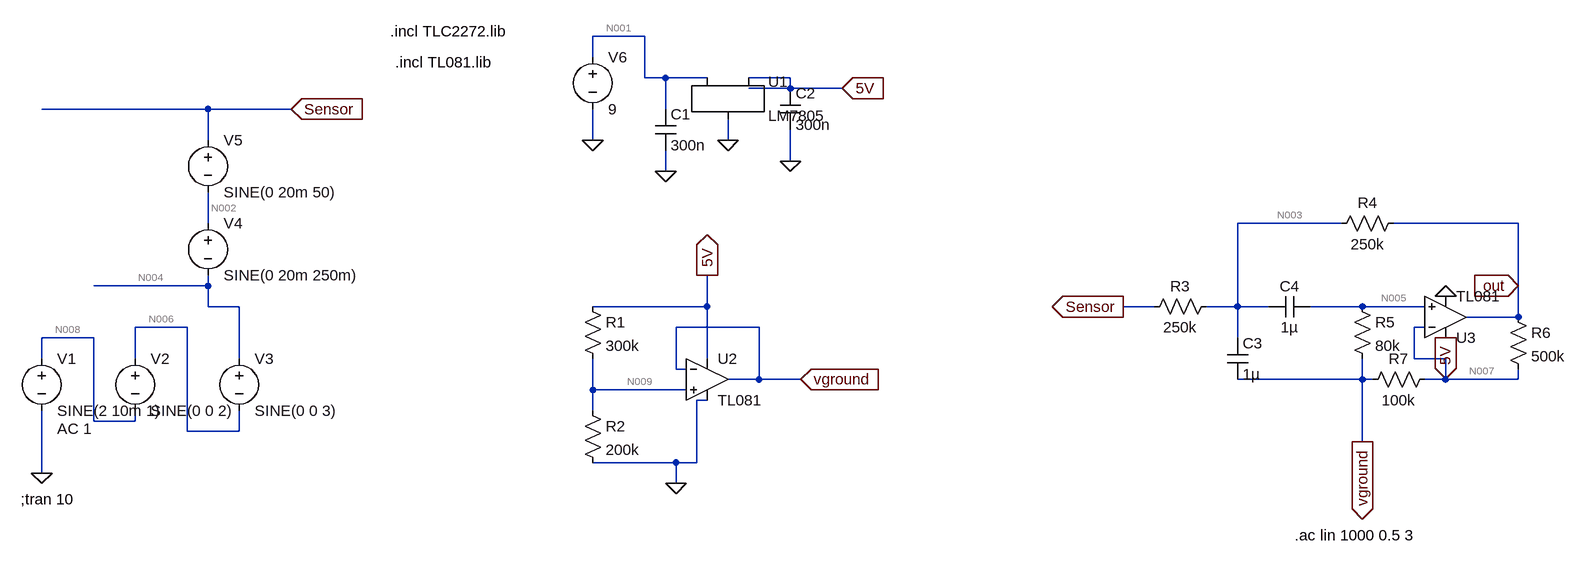
[diagram p0: schematic cakez.asc]
cakez.asc, the LTspice schematic file:
Version 4
SHEET 1 3344 680
WIRE 1024 -224 944 -224
WIRE 944 -192 944 -224
WIRE 1024 -160 1024 -224
WIRE 1056 -160 1024 -160
WIRE 1120 -160 1056 -160
WIRE 1248 -160 1184 -160
WIRE 1248 -144 1248 -160
WIRE 1248 -144 1184 -144
WIRE 1328 -144 1248 -144
WIRE 1248 -128 1248 -144
WIRE 352 -112 96 -112
WIRE 480 -112 352 -112
WIRE 1056 -112 1056 -160
WIRE 352 -64 352 -112
WIRE 944 -64 944 -112
WIRE 1152 -64 1152 -96
WIRE 1248 -32 1248 -80
WIRE 1056 -16 1056 -48
WIRE 352 64 352 16
WIRE 2096 64 1936 64
WIRE 2368 64 2176 64
WIRE 352 160 352 144
WIRE 352 160 176 160
WIRE 2368 160 2368 64
WIRE 352 192 352 160
WIRE 400 192 352 192
WIRE 1120 192 1120 144
WIRE 1120 192 944 192
WIRE 1808 192 1760 192
WIRE 1936 192 1936 64
WIRE 1936 192 1888 192
WIRE 1984 192 1936 192
WIRE 2128 192 2048 192
WIRE 2224 192 2128 192
WIRE 2368 208 2368 160
WIRE 2368 208 2288 208
WIRE 320 224 240 224
WIRE 1200 224 1072 224
WIRE 2224 224 2208 224
WIRE 176 240 96 240
WIRE 1936 240 1936 192
WIRE 96 272 96 240
WIRE 240 272 240 224
WIRE 400 272 400 192
WIRE 1120 272 1120 192
WIRE 2208 272 2208 224
WIRE 2256 272 2208 272
WIRE 1072 288 1072 224
WIRE 1088 288 1072 288
WIRE 1200 304 1200 224
WIRE 1200 304 1152 304
WIRE 1264 304 1200 304
WIRE 2128 304 2128 272
WIRE 2128 304 1936 304
WIRE 2144 304 2128 304
WIRE 2256 304 2256 272
WIRE 2256 304 2224 304
WIRE 2368 304 2368 288
WIRE 2368 304 2256 304
WIRE 944 320 944 272
WIRE 1088 320 944 320
WIRE 1120 336 1104 336
WIRE 944 352 944 320
WIRE 176 368 176 240
WIRE 240 368 240 352
WIRE 240 368 176 368
WIRE 320 384 320 224
WIRE 400 384 400 352
WIRE 400 384 320 384
WIRE 2128 400 2128 304
WIRE 1072 432 944 432
WIRE 1104 432 1104 336
WIRE 1104 432 1072 432
WIRE 96 448 96 352
WIRE 1072 464 1072 432
FLAG 96 448 0
FLAG 480 -112 Sensor
IOPIN 480 -112 In
FLAG 944 -64 0
FLAG 1056 -16 0
FLAG 1248 -32 0
FLAG 1328 -144 5V
IOPIN 1328 -144 In
FLAG 1120 144 5V
IOPIN 1120 144 Out
FLAG 1072 464 0
FLAG 1264 304 vground
IOPIN 1264 304 In
FLAG 1152 -64 0
FLAG 2256 176 0
FLAG 2368 160 out
IOPIN 2368 160 In
FLAG 1760 192 Sensor
IOPIN 1760 192 Out
FLAG 2256 240 5V
IOPIN 2256 240 Out
FLAG 2128 400 vground
IOPIN 2128 400 Out
SYMBOL voltage 96 256 R0
WINDOW 123 24 124 Left 2
WINDOW 39 0 0 Left 0
SYMATTR Value2 AC 1
SYMATTR InstName V1
SYMATTR Value SINE(2 10m 1)
SYMBOL voltage 240 256 R0
WINDOW 123 0 0 Left 0
WINDOW 39 0 0 Left 0
SYMATTR InstName V2
SYMATTR Value SINE(0 0 2)
SYMBOL voltage 400 256 R0
WINDOW 123 0 0 Left 0
WINDOW 39 0 0 Left 0
SYMATTR InstName V3
SYMATTR Value SINE(0 0 3)
SYMBOL voltage 352 48 R0
WINDOW 123 0 0 Left 0
WINDOW 39 0 0 Left 0
SYMATTR InstName V4
SYMATTR Value SINE(0 20m 250m)
SYMBOL voltage 352 -80 R0
WINDOW 123 0 0 Left 0
WINDOW 39 0 0 Left 0
SYMATTR InstName V5
SYMATTR Value SINE(0 20m 50)
SYMBOL voltage 944 -208 R0
WINDOW 123 0 0 Left 0
WINDOW 39 0 0 Left 0
SYMATTR InstName V6
SYMATTR Value 9
SYMBOL cap 1232 -144 R0
SYMATTR InstName C2
SYMATTR Value 300n
SYMBOL cap 1040 -112 R0
SYMATTR InstName C1
SYMATTR Value 300n
SYMBOL res 928 176 R0
SYMATTR InstName R1
SYMATTR Value 300k
SYMBOL res 928 336 R0
SYMATTR InstName R2
SYMATTR Value 200k
SYMBOL Opamps\\opamp2 1120 240 R0
SYMATTR InstName U2
SYMATTR Value TL081
SYMBOL LM7805 1152 -144 R0
SYMATTR InstName U1
SYMBOL res 1904 176 R90
WINDOW 0 0 56 VBottom 2
WINDOW 3 32 56 VTop 2
SYMATTR InstName R3
SYMATTR Value 250k
SYMBOL cap 1920 240 R0
SYMATTR InstName C3
SYMATTR Value 1µ
SYMBOL cap 2048 176 R90
WINDOW 0 0 32 VBottom 2
WINDOW 3 32 32 VTop 2
SYMATTR InstName C4
SYMATTR Value 1µ
SYMBOL res 2192 48 R90
WINDOW 0 0 56 VBottom 2
WINDOW 3 32 56 VTop 2
SYMATTR InstName R4
SYMATTR Value 250k
SYMBOL res 2112 176 R0
SYMATTR InstName R5
SYMATTR Value 80k
SYMBOL Opamps\\opamp2 2256 272 M180
SYMATTR InstName U3
SYMATTR Value TL081
SYMBOL res 2352 192 R0
SYMATTR InstName R6
SYMATTR Value 500k
SYMBOL res 2240 288 R90
WINDOW 0 0 56 VBottom 2
WINDOW 3 32 56 VTop 2
SYMATTR InstName R7
SYMATTR Value 100k
TEXT 64 488 Left 2 !;tran 10
TEXT 640 -184 Left 2 !.incl TL081.lib
TEXT 632 -232 Left 2 !.incl TLC2272.lib
TEXT 2024 544 Left 2 !.ac lin 1000 0.5 3

The netlist it stands for:
* cakez.asc
V1 N008 0 SINE(2 10m 1) AC 1
V2 N006 N008 SINE(0 0 2)
V3 N004 N006 SINE(0 0 3)
V4 N002 N004 SINE(0 20m 250m)
V5 Sensor N002 SINE(0 20m 50)
V6 N001 0 9
C2 5V 0 300n
C1 N001 0 300n
R1 5V N009 300k
R2 N009 0 200k
XU2 N009 vground 5V 0 vground TL081  ; pins In+ In- V+ V- OUT
XU1 N001 0 5V LM7805
R3 N003 Sensor 250k
C3 N003 vground 1µ
C4 N005 N003 1µ
R4 out N003 250k
R5 N005 vground 80k
XU3 N005 N007 5V 0 out TL081  ; pins In+ In- V+ V- OUT
R6 out N007 500k
R7 N007 vground 100k
;tran 10
.incl TL081.lib
.incl TLC2272.lib
.ac lin 1000 0.5 3
.backanno
.end

* Results of the author's LTspice run, read from the files saved beside the schematic
* Operating Point, zero values left out:
*   V(n008) = 2 V
*   V(n006) = 2 V
*   V(n004) = 2 V
*   V(n002) = 2 V
*   V(sensor) = 2 V
*   V(n001) = 9 V
*   V(5v) = 5.003 V
*   V(n009) = 2.001 V
*   V(vground) = 2.001 V
*   V(n003) = 2.001 V
*   V(n005) = 2.001 V
*   V(out) = 2.001 V
*   V(n007) = 2.001 V
*   I(R7) = 243.1 pA
*   I(R6) = 275.1 pA
*   I(R5) = -32.05 pA
*   I(R4) = 2.645 nA
*   I(R3) = 2.645 nA
*   I(R2) = 10.01 µA
*   I(R1) = 10.01 µA
*   I(V6) = -10.09 mA
*   I(V5) = 2.645 nA
*   I(V4) = 2.645 nA
*   I(V3) = 2.645 nA
*   I(V2) = 2.645 nA
*   I(V1) = 2.645 nA
*   Ix(u2:1) = 32.05 pA
*   Ix(u2:2) = 32.05 pA
*   Ix(u2:3) = 2.53 mA
*   Ix(u2:4) = -2.53 mA
*   Ix(u2:5) = 179 pA
*   Ix(u1:1) = 10.09 mA
*   Ix(u1:2) = -5.02 mA
*   Ix(u1:3) = -5.069 mA
*   Ix(u3:1) = 32.05 pA
*   Ix(u3:2) = 32.05 pA
*   Ix(u3:3) = 2.53 mA
*   Ix(u3:4) = -2.53 mA
*   Ix(u3:5) = -2.92 nA
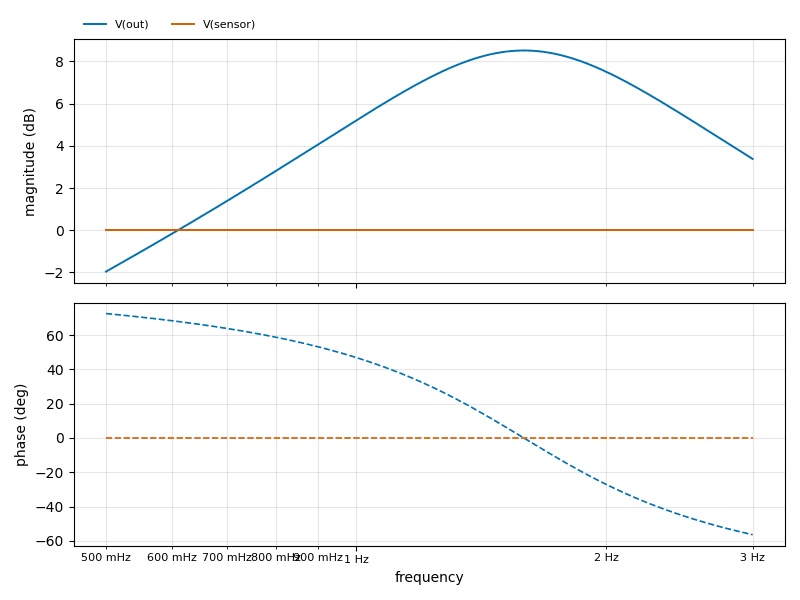
[diagram p1: AC Analysis of cakez.asc, plotted from the saved traces]
* AC Analysis, 1 run:
*   V(out): -1.96 dB at 500 mHz, 3.38 dB at 3 Hz, peak 8.52 dB at 1.591 Hz, 3 dB below the peak at 1.029 Hz and 2.462 Hz
*   V(sensor): 0.00 dB at 500 mHz, 0.00 dB at 3 Hz, peak 0.00 dB at 500 mHz